# EAGLE design VFD-Converter (EAGLE 7.1.0)
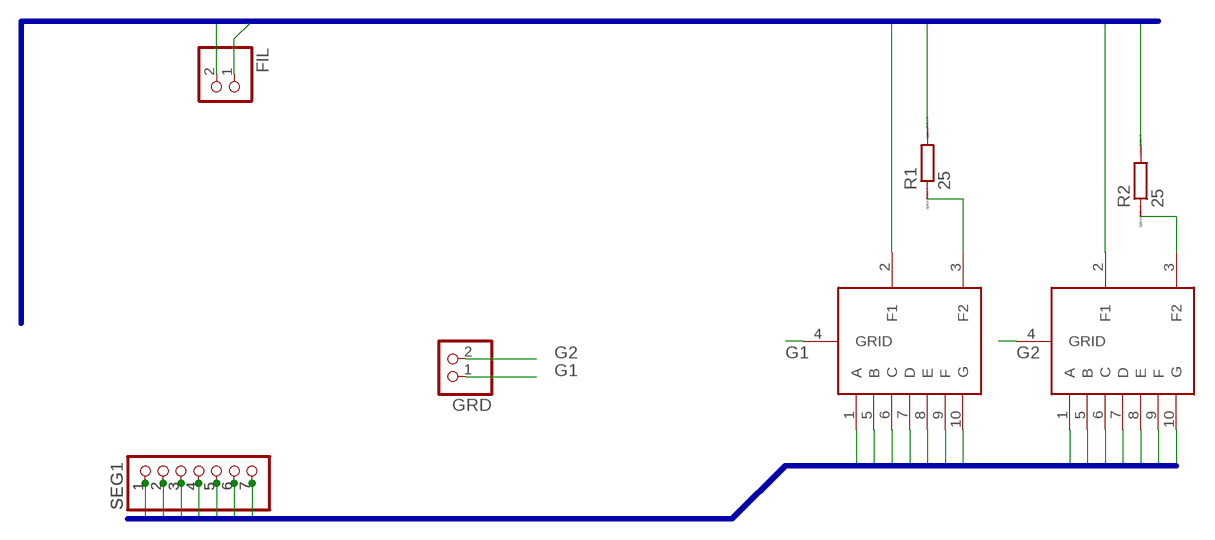
[diagram p0: schematic, sheet 1]

## Parts
FIL  PINHD-1X2  [1X02]
GRD  PINHD-1X2  [1X02]
R1  25  R-EU_M0805  [M0805]
R2  25  R-EU_M0805  [M0805]
SEG  PINHD-1X7  [1X07]
SEG1  PINHD-1X7  [1X07]
U$5  IV-12  [NIXIE-11]
U$6  IV-12  [NIXIE-11]

## Nets
F1: FIL.1 U$5.2(F1) U$6.2(F1)
F2: FIL.2 R1.2 R2.2
G1: GRD.1 U$5.4(GRID)
G2: GRD.2 U$6.4(GRID)
N$1: R2.1 U$6.3(F2)
N$2: R1.1 U$5.3(F2)
SEG1: SEG1.1 SEG.1 U$5.1(A) U$6.1(A)
SEG2: SEG1.2 SEG.2 U$5.5(B) U$6.5(B)
SEG3: SEG1.3 SEG.3 U$5.6(C) U$6.6(C)
SEG4: SEG1.4 SEG.4 U$5.7(D) U$6.7(D)
SEG5: SEG1.5 SEG.5 U$5.8(E) U$6.8(E)
SEG6: SEG1.6 SEG.6 U$5.9(F) U$6.9(F)
SEG7: SEG1.7 SEG.7 U$5.10(G) U$6.10(G)

## Buses
F[1..2]
SEG[1..9]

## Library data of the parts
FIL GRD = pinhead:PINHD-1X2: PIN HEADER
R1 R2 = resistor:R-EU_: RESISTOR, European symbol; SPICEPREFIX: R
SEG SEG1 = pinhead:PINHD-1X7: PIN HEADER
U$5 U$6 = RalimTek:IV-12

## Board
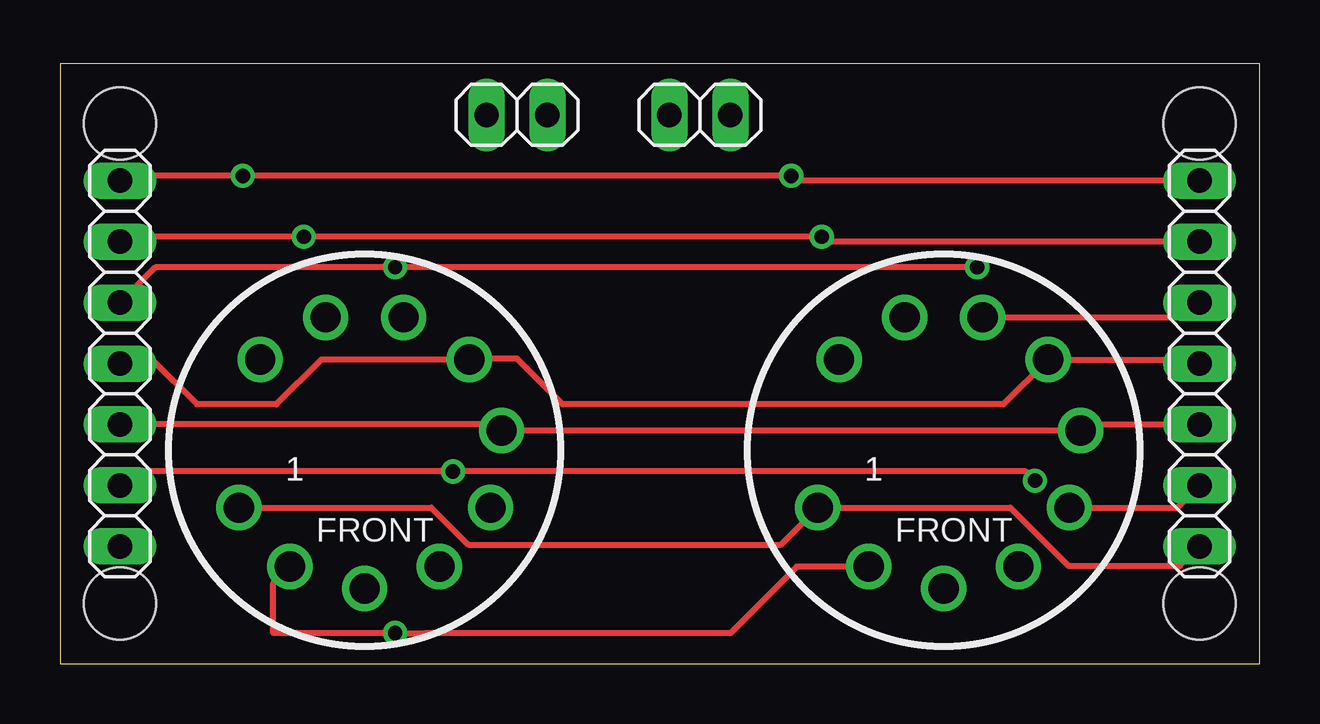
[diagram p1: board, top side]
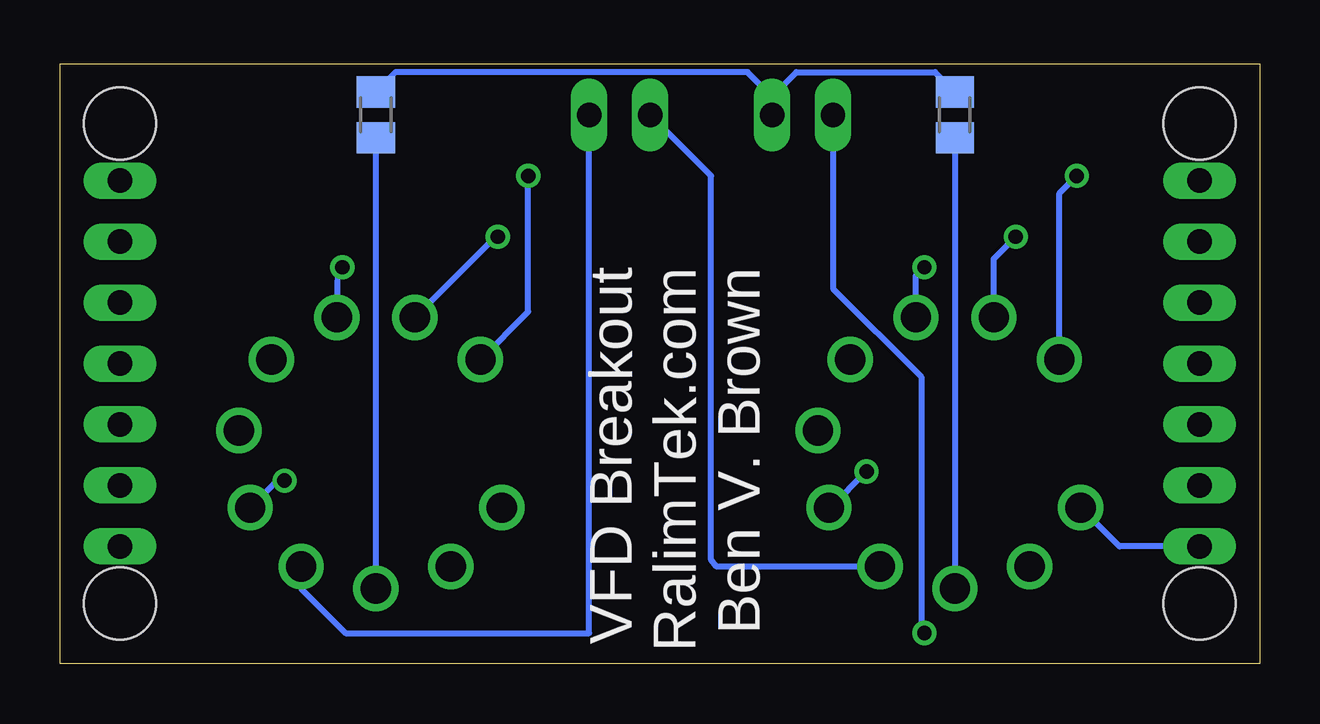
[diagram p2: board, bottom side, seen from below]

Size 50 x 25 mm. Coordinates in mm from the lower left corner, seen from the top.
Outline: 0,0 50,0 50,25 0,25 0,0
Copper layers (1*16): Top 0.035mm / dielectric 1.5mm / Bottom 0.035mm
Design rules "default": minimum track width 10mil, minimum drill 24mil, track to track 8mil, track to pad 8mil, pad to pad 8mil, via to via 8mil, smd to smd 8mil, copper to edge 40mil, drill to drill 8mil, minimum pad ring 10mil, minimum via ring 8mil, stop-mask expansion 4mil, vias tented up to drill 0mil, thermal gap 10mil
Holes 3 mm at 47.5,22.5 47.5,2.5 2.5,2.5 2.5,22.5

### Footprints (pad centres in the part's own frame; a part is rotated, then mirrored left to right if it is on the bottom)
1X02 = drill 1.016 long: 1 -1.27,0; 2 1.27,0
M0805 = smd 1.3 x 1.6: 1 -0.95,0; 2 0.95,0
1X07 = drill 1.016 long: 1 -7.62,0; 2 -5.08,0; 3 -2.54,0; 4 0,0; 5 2.54,0; 6 5.08,0; 7 7.62,0
NIXIE-11 = drill 1.26: 1 -5.246,-2.396; 2 -3.118,-4.851; 3 0,-5.767; 4 3.118,-4.851; 5 5.246,-2.396; 6 5.708,0.821; 7 4.358,3.776; 8 1.625,5.533; 9 -1.625,5.533; 10 -4.358,3.776

### Placement (x,y rotation side)
FIL  19.05,22.86 0 top
GRD  26.67,22.86 0 top
R1  12.7,22.86 90 bottom
R2  36.83,22.86 90 bottom
SEG  47.5,12.5 90 top
SEG1  2.5,12.5 90 top
U$5  12.7,8.89 0 top
U$6  36.83,8.89 0 top

### Tracks (layer width: path | path; a pad name or v marks a point on that pad's centre or on a via)
F1  (via drill 0.6)
  Top 0.254: U$6.2 30.71,4.04 27.94,1.27 15.24,1.27 v13.97,1.27 8.89,1.27 8.89,3.35 U$5.2
  Bottom 0.254: FIL.1 17.78,15.62 14.1,11.94 14.1,1.4 v13.97,1.27
F2
  Bottom 0.254: FIL.2 20.32,23.62 | 20.32,23.62 19.3,24.64 13.53,24.64 R1.2 | 20.32,23.62 21.34,24.64 36,24.64 R2.2
G1
  Bottom 0.254: U$5.4 22.63,4.04 22.86,4.32 22.86,20.32 GRD.1
G2
  Bottom 0.254: U$6.4 39.95,3.12 38.1,1.27 27.94,1.27 GRD.2
N$1
  Bottom 0.254: U$6.3 R2.1
N$2
  Bottom 0.254: R1.1 U$5.3
SEG1
  Top 0.254: U$5.1 15.48,6.49 17.02,4.95 30.04,4.95 U$6.1 39.61,6.49 42.04,4.06 46.68,4.06 SEG.1
  Bottom 0.254: SEG1.1 5.84,4.88 U$5.1
SEG2  (via drill 0.6)
  Top 0.254: SEG1.2 3.08,8 v16.38,8 40.26,8 v40.64,7.62 | U$6.5 46.57,6.49 SEG.2
  Bottom 0.254: U$5.5 17.89,6.49 v16.38,8 | U$6.5 40.95,7.62 v40.64,7.62
SEG3
  Top 0.254: SEG.3 42.79,9.96 U$6.6 U$5.6 18.16,9.96 SEG1.3
SEG4
  Top 0.254: SEG1.4 2.7,12.7 3.81,12.7 5.71,10.79 9.02,10.79 10.89,12.67 U$5.7 17.09,12.7 19.05,12.7 20.95,10.79 39.32,10.79 U$6.7 47.33,12.67 SEG.4
SEG5  (via drill 0.6)
  Top 0.254: SEG1.5 3.97,16.51 v13.97,16.51 v38.23,16.51 | U$6.8 46.88,14.42 SEG.5
  Bottom 0.254: U$5.8 14.32,16.16 v13.97,16.51 | U$6.8 38.4,16.51 v38.23,16.51
SEG6  (via drill 0.6)
  Top 0.254: SEG1.6 2.7,17.78 v10.16,17.78 v31.75,17.78 31.95,17.58 SEG.6
  Bottom 0.254: U$5.9 11.07,16.86 v10.16,17.78 | U$6.9 31.85,17.78 v31.75,17.78
SEG7  (via drill 0.6)
  Top 0.254: SEG1.7 2.7,20.32 v7.62,20.32 v30.48,20.32 30.68,20.12 SEG.7
  Bottom 0.254: U$5.10 8.34,19.6 v7.62,20.32 | U$6.10 30.48,14.66 v30.48,20.32

### Text on the board
bPlace: VFD Breakout / RalimTek.com / Ben V. Brown